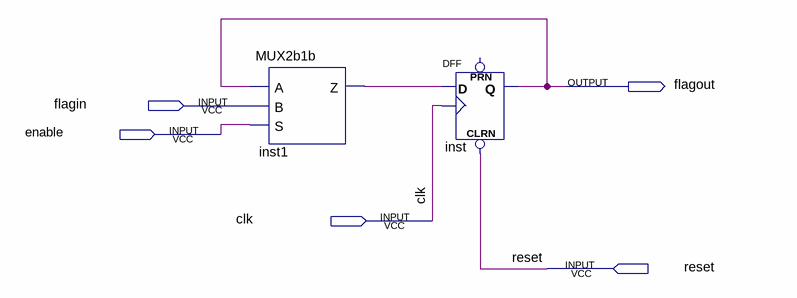
[diagram p0: schematic sheet]
// Quartus schematic register1b.bdf as structural Verilog: 2 symbols, 5 pins
module register1b (
  input  flagin,
  input  enable,
  input  clk,
  input  reset,
  output flagout
);

  wire inst1_z;

  MUX2b1b inst1 (.A(flagout), .B(flagin), .S(enable), .Z(inst1_z));
  DFF inst (.CLRN(reset), .CLK(clk), .D(inst1_z), .Q(flagout));  // open: PRN
endmodule
